# EAGLE design musicbox-addon (EAGLE 9.6.2)
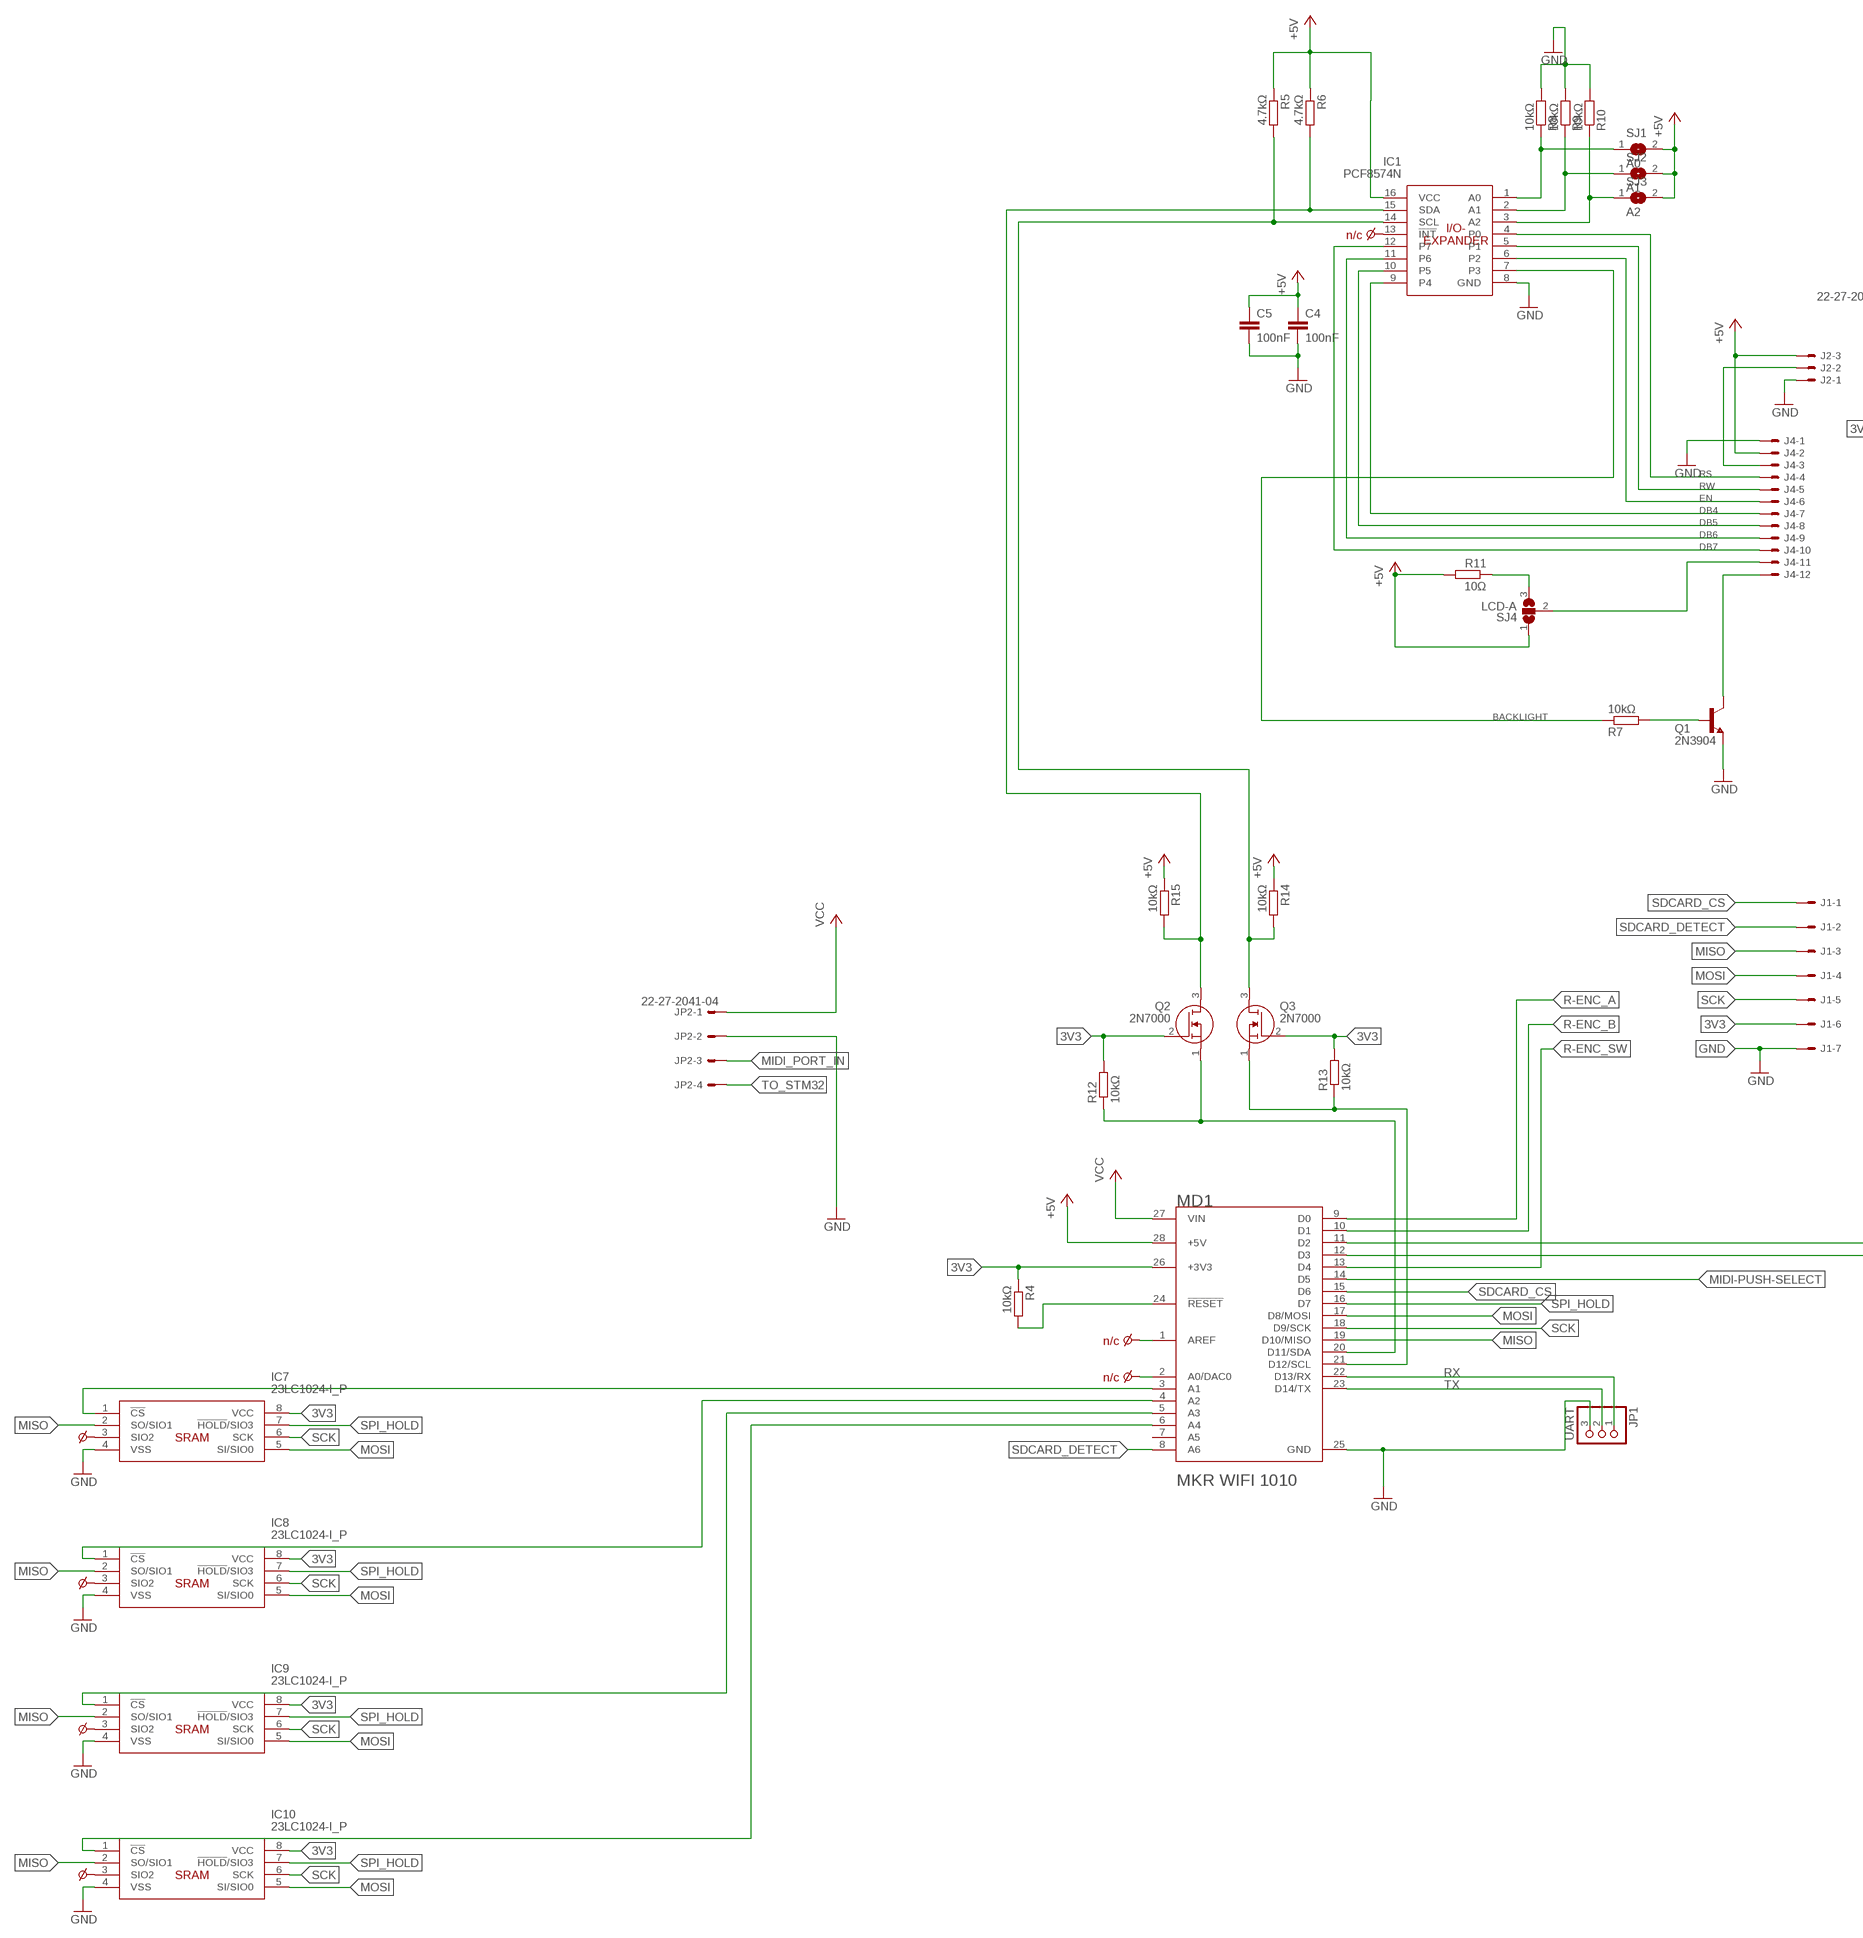
[diagram p0: schematic, sheet 1, part 1 of 2]
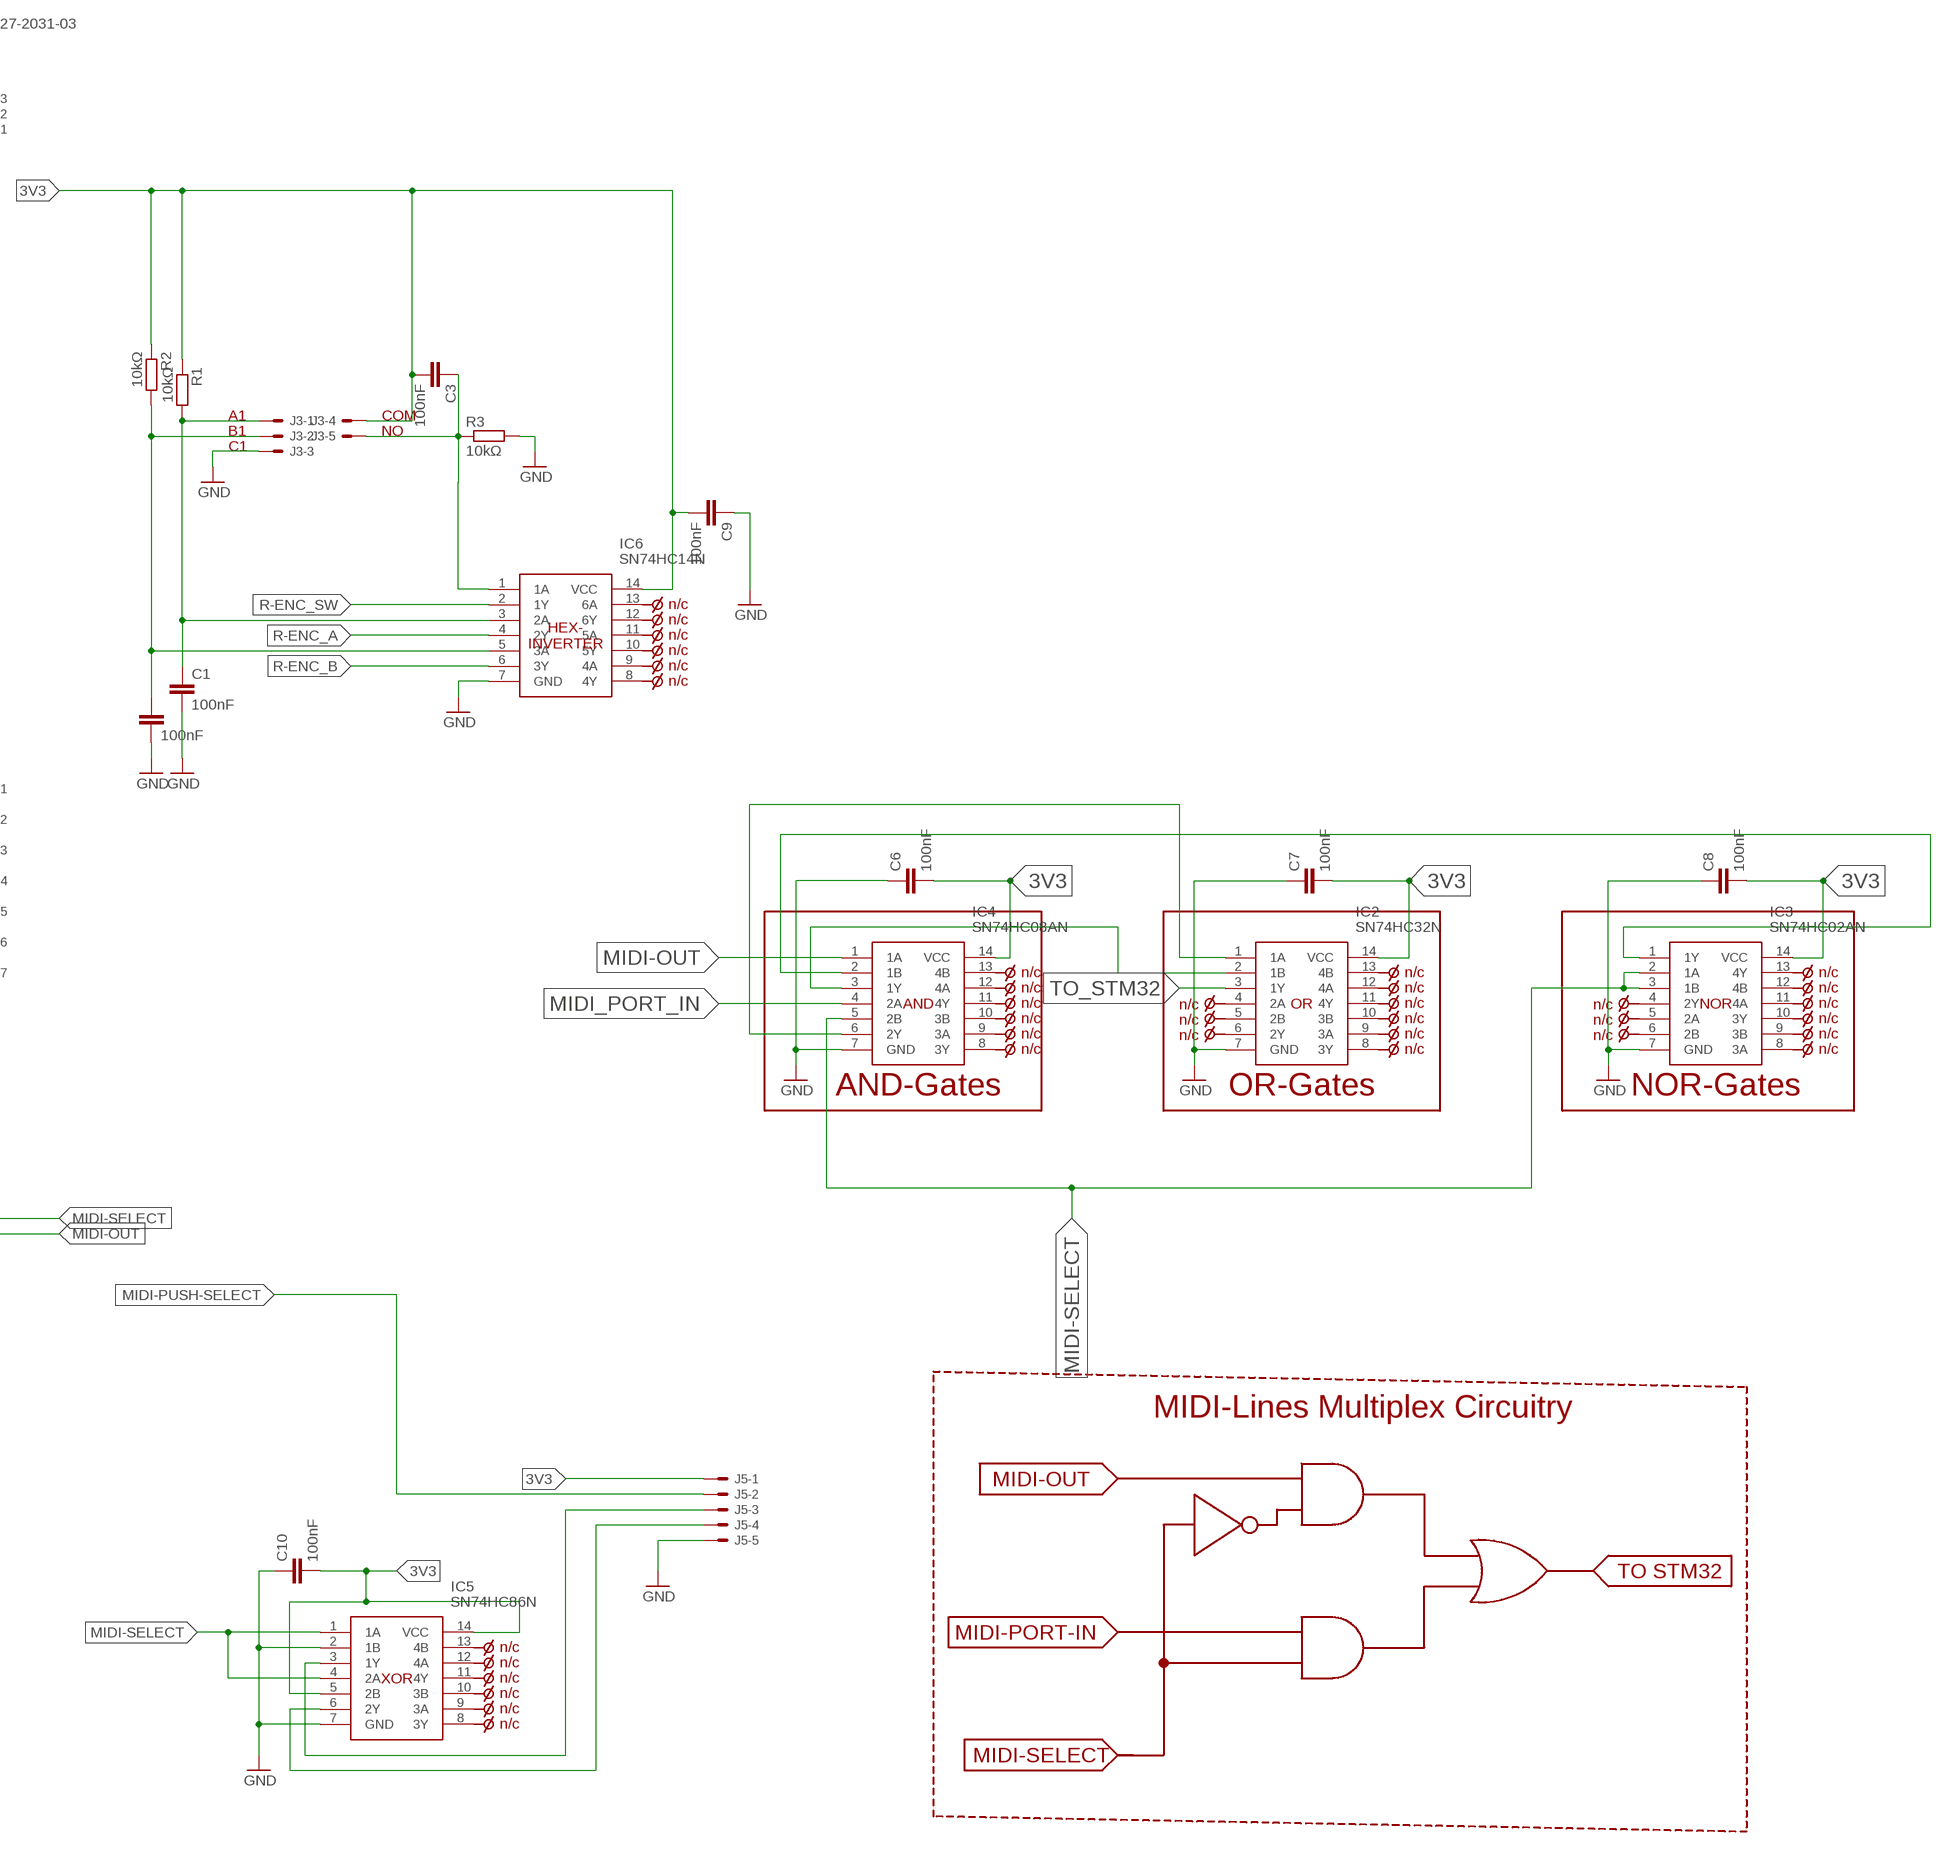
[diagram p1: schematic, sheet 1, part 2 of 2]

## Parts
C1  100nF  C-EU025-025X050  [C025-025X050]
C2  100nF  C-EU025-025X050  [C025-025X050]
C3  100nF  C-EU025-025X050  [C025-025X050]
C4  100nF  C-EU025-025X050  [C025-025X050]
C5  100nF  C-EU025-025X050  [C025-025X050]
C6  100nF  C-EU025-025X050  [C025-025X050]
C7  100nF  C-EU025-025X050  [C025-025X050]
C8  100nF  C-EU025-025X050  [C025-025X050]
C9  100nF  C-EU025-025X050  [C025-025X050]
C10  100nF  C-EU025-025X050  [C025-025X050]
IC1  PCF8574N  [DIP794W53P254L1930H508Q16N]
IC2  SN74HC32N  [DIP794W53P254L1930H508Q14N]
IC3  SN74HC02AN  [DIP794W53P254L1930H508Q14N]
IC4  SN74HC08AN  [DIP794W53P254L1930H508Q14N]
IC5  SN74HC86N  [DIP794W53P254L1930H508Q14N]
IC6  SN74HC14N  [DIP794W53P254L1930H508Q14N]
IC7  23LC1024-I_P  [DIP781W56P254L950H533Q8N]
IC8  23LC1024-I_P  [DIP781W56P254L950H533Q8N]
IC9  23LC1024-I_P  [DIP781W56P254L950H533Q8N]
IC10  23LC1024-I_P  [DIP781W56P254L950H533Q8N]
J1  22-27-2071-07  [6410-07]
J2  22-27-2031-03  [6410-03]
J3  22-27-2051-05  [6410-05]
J4  22-27-2121-12  [6410-12]
J5  22-27-2051-05  [6410-05]
JP1  UART  PINHD-1X3  [1X03]
JP2  22-27-2041-04  [6410-04]
MD1  ARDUINO_MKR_WIFI_1010ARDUINO_MKR_WIFI_1010_0_0  [ARDUINO_MKR_WIFI_1010_0]
Q1  2N3904  [TO92]
Q2  2N7000  [TO-92_(TO-226)]
Q3  2N7000  [TO-92_(TO-226)]
R1  10kΩ  R-EU_0207/7  [0207/7]
R2  10kΩ  R-EU_0207/7  [0207/7]
R3  10kΩ  R-EU_0207/7  [0207/7]
R4  10kΩ  R-EU_0207/7  [0207/7]
R5  4.7kΩ  R-EU_0207/7  [0207/7]
R6  4.7kΩ  R-EU_0207/7  [0207/7]
R7  10kΩ  R-EU_0207/7  [0207/7]
R8  10kΩ  R-EU_0207/7  [0207/7]
R9  10kΩ  R-EU_0207/7  [0207/7]
R10  10kΩ  R-EU_0207/7  [0207/7]
R11  10Ω  R-EU_0207/7  [0207/7]
R12  10kΩ  R-EU_0207/7  [0207/7]
R13  10kΩ  R-EU_0207/7  [0207/7]
R14  10kΩ  R-EU_0207/7  [0207/7]
R15  10kΩ  R-EU_0207/7  [0207/7]
SJ1  A0  SJ  [SJ]
SJ2  A1  SJ  [SJ]
SJ3  A2  SJ  [SJ]
SJ4  LCD-A  SJ2W  [SJ_2]
U$1  N/C-ALT-WITH-TEXT  (no package)
U$2  N/C-ALT-WITH-TEXT  (no package)
U$3  N/C-ALT-WITH-TEXT  (no package)
U$4  N/C-ALT-WITH-TEXT  (no package)
U$5  N/C-ALT-WITH-TEXT  (no package)
U$6  N/C-ALT-WITH-TEXT  (no package)
U$7  N/C-ALT-WITH-TEXT  (no package)
U$8  N/C-ALT-WITH-TEXT  (no package)
U$9  N/C-ALT-WITH-TEXT  (no package)
U$10  N/C-ALT-WITH-TEXT  (no package)
U$11  N/C-ALT-WITH-TEXT  (no package)
U$12  N/C-ALT-WITH-TEXT  (no package)
U$13  N/C-ALT-WITH-TEXT  (no package)
U$14  N/C-ALT-WITH-TEXT  (no package)
U$15  N/C-ALT-WITH-TEXT  (no package)
U$16  N/C-ALT-WITH-TEXT  (no package)
U$17  N/C-ALT  (no package)
U$18  N/C-ALT  (no package)
U$19  N/C-ALT  (no package)
U$20  N/C-ALT  (no package)
U$21  N/C-ALT-WITH-TEXT  (no package)
U$22  N/C-ALT-WITH-TEXT  (no package)
U$23  N/C-ALT-WITH-TEXT  (no package)
U$24  N/C-ALT-WITH-TEXT  (no package)
U$25  N/C-ALT-WITH-TEXT  (no package)
U$26  N/C-ALT-WITH-TEXT  (no package)
U$27  N/C-ALT-WITH-TEXT  (no package)
U$28  N/C-ALT-WITH-TEXT  (no package)
U$29  N/C-ALT-WITH-TEXT  (no package)
U$30  N/C-ALT-WITH-TEXT  (no package)
U$31  N/C-ALT-WITH-TEXT  (no package)
U$32  N/C-ALT-WITH-TEXT  (no package)
U$33  N/C-ALT-WITH-TEXT  (no package)
U$34  N/C-ALT-WITH-TEXT  (no package)
U$35  N/C-ALT-WITH-TEXT  (no package)
U$36  N/C-ALT-WITH-TEXT  (no package)
U$37  N/C-ALT-WITH-TEXT  (no package)
U$38  N/C-ALT-WITH-TEXT  (no package)
U$39  N/C-ALT-WITH-TEXT  (no package)
U$40  N/C-ALT-WITH-TEXT  (no package)
U$41  N/C-ALT-WITH-TEXT  (no package)
U$42  N/C-ALT-WITH-TEXT  (no package)
U$43  N/C-ALT-WITH-TEXT  (no package)

## Nets
3V3: C3.2 C6.2 C7.2 C8.2 C9.2 C10.2 IC2.14(VCC) IC3.14(VCC) IC4.14(VCC) IC5.5(2B) IC5.14(VCC) IC6.14(VCC) IC7.8(VCC) IC8.8(VCC) IC9.8(VCC) IC10.8(VCC) J1.6 J3.4 J5.1 MD1.26(+3V3) Q2.2(G) Q3.2(G) R1.1 R2.1 R4.1 R12.2 R13.2
+5V: C4.1 C5.1 IC1.16(VCC) J2.3 J4.2 MD1.28(+5V) R5.1 R6.1 R11.2 R14.1 R15.1 SJ1.2 SJ2.2 SJ3.2 SJ4.1
BACKLIGHT: IC1.7(P3) R7.1
DB4: IC1.9(P4) J4.7
DB5: IC1.10(P5) J4.8
DB6: IC1.11(P6) J4.9
DB7: IC1.12(P7) J4.10
EN: IC1.6(P2) J4.6
GND: C1.2 C2.2 C4.2 C5.2 C6.1 C7.1 C8.1 C9.1 C10.1 IC1.8(GND) IC2.7(GND) IC3.7(GND) IC4.7(GND) IC5.2(1B) IC5.7(GND) IC6.7(GND) IC7.4(VSS) IC8.4(VSS) IC9.4(VSS) IC10.4(VSS) J1.7 J2.1 J3.3 J4.1 J5.5 JP1.3 JP2.2 MD1.25(GND) Q1.3(E) R3.2 R8.2 R9.2 R10.2
I2C_SCL: IC1.14(SCL) Q3.3(D) R5.2 R14.2
I2C_SDA: IC1.15(SDA) Q2.3(D) R6.2 R15.2
MIDI-OUT: IC4.1(1A) MD1.12(D3)
MIDI-PUSH-SELECT: J5.2 MD1.14(D5)
MIDI-SELECT: IC3.2(1A) IC3.3(1B) IC4.5(2B) IC5.1(1A) IC5.4(2A) MD1.11(D2)
MIDI_PORT_IN: IC4.4(2A) JP2.3
MISO: IC7.2(SO/SIO1) IC8.2(SO/SIO1) IC9.2(SO/SIO1) IC10.2(SO/SIO1) J1.3 MD1.19(D10/MISO)
MOSI: IC7.5(SI/SIO0) IC8.5(SI/SIO0) IC9.5(SI/SIO0) IC10.5(SI/SIO0) J1.4 MD1.17(D8/MOSI)
N$1: IC1.3(A2) R10.1 SJ3.1
N$2: IC1.1(A0) R8.1 SJ1.1
N$3: IC1.2(A1) R9.1 SJ2.1
N$5: C3.1 IC6.1(1A) J3.5 R3.1
N$6: MD1.24(!RESET!) R4.2
N$7: MD1.21(D12/SCL) Q3.1(S) R13.1
N$8: MD1.1(AREF) U$1.P$1
N$9: IC2.2(1B) IC4.3(1Y)
N$10: IC3.1(1Y) IC4.2(1B)
N$11: IC2.1(1A) IC4.6(2Y)
N$12: J4.11 SJ4.2
N$13: IC6.13(6A) U$2.P$1
N$14: IC6.12(6Y) U$3.P$1
N$15: IC6.11(5A) U$4.P$1
N$16: R11.1 SJ4.3
N$17: IC6.10(5Y) U$5.P$1
N$18: IC5.3(1Y) J5.3
N$19: IC5.6(2Y) J5.4
N$20: IC6.9(4A) U$6.P$1
N$21: IC6.8(4Y) U$7.P$1
N$22: IC1.13(!INT) U$8.P$1
N$23: MD1.20(D11/SDA) Q2.1(S) R12.1
N$24: IC7.3(SIO2) U$17.P$1
N$25: IC8.3(SIO2) U$18.P$1
N$26: IC9.3(SIO2) U$19.P$1
N$27: Q1.2(B) R7.2
N$28: IC10.3(SIO2) U$20.P$1
N$29: J2.2 J4.3
N$30: IC7.1(!CS) MD1.3(A1)
N$31: MD1.2(A0/DAC0) U$9.P$1
N$32: IC5.13(4B) U$10.P$1
N$33: IC5.12(4A) U$11.P$1
N$34: IC8.1(!CS) MD1.4(A2)
N$35: IC9.1(!CS) MD1.5(A3)
N$36: IC10.1(!CS) MD1.6(A4)
N$37: IC5.11(4Y) U$12.P$1
N$38: J4.12 Q1.1(C)
N$39: IC5.10(3B) U$13.P$1
N$40: IC5.9(3A) U$14.P$1
N$41: IC5.8(3Y) U$15.P$1
N$42: IC4.13(4B) U$16.P$1
N$44: IC4.12(4A) U$21.P$1
N$45: IC4.11(4Y) U$22.P$1
N$46: IC4.10(3B) U$23.P$1
N$47: IC4.9(3A) U$24.P$1
N$48: IC4.8(3Y) U$25.P$1
N$49: IC2.13(4B) U$26.P$1
N$50: IC2.12(4A) U$27.P$1
N$51: IC2.11(4Y) U$28.P$1
N$52: IC2.10(3B) U$29.P$1
N$53: IC2.9(3A) U$30.P$1
N$54: IC2.8(3Y) U$31.P$1
N$55: IC2.4(2A) U$32.P$1
N$56: IC2.5(2B) U$33.P$1
N$57: IC2.6(2Y) U$34.P$1
N$58: IC3.4(2Y) U$35.P$1
N$59: IC3.5(2A) U$36.P$1
N$60: IC3.6(2B) U$37.P$1
N$61: IC3.13(4Y) U$38.P$1
N$62: IC3.12(4B) U$39.P$1
N$63: IC3.11(4A) U$40.P$1
N$64: IC3.10(3Y) U$41.P$1
N$65: IC3.9(3B) U$42.P$1
N$66: IC3.8(3A) U$43.P$1
R-ENC_A: IC6.4(2Y) MD1.9(D0)
R-ENC_B: IC6.6(3Y) MD1.10(D1)
R-ENC_SW: IC6.2(1Y) MD1.13(D4)
R_ENC_A: C1.1 IC6.3(2A) J3.1 R1.2
R_ENC_B: C2.1 IC6.5(3A) J3.2 R2.2
RS: IC1.4(P0) J4.4
RW: IC1.5(P1) J4.5
RX: JP1.1 MD1.22(D13/RX)
SCK: IC7.6(SCK) IC8.6(SCK) IC9.6(SCK) IC10.6(SCK) J1.5 MD1.18(D9/SCK)
SDCARD_CS: J1.1 MD1.15(D6)
SDCARD_DETECT: J1.2 MD1.8(A6)
SPI_HOLD: IC7.7(!HOLD!/SIO3) IC8.7(!HOLD!/SIO3) IC9.7(!HOLD!/SIO3) IC10.7(!HOLD!/SIO3) MD1.16(D7)
TO_STM32: IC2.3(1Y) JP2.4
TX: JP1.2 MD1.23(D14/TX)
VCC: JP2.1 MD1.27(VIN)
Unconnected: MD1.7(A5)

## Notes on the sheet
- I/O-
  EXPANDER
- A1 | COM
- B1 | NO
- C1
- HEX-
  INVERTER
- AND | OR | NOR
- AND-Gates | OR-Gates | NOR-Gates
- MIDI-Lines Multiplex Circuitry
- SRAM
- MIDI-OUT
- TO STM32
- MIDI-PORT-IN
- SRAM
- XOR
- MIDI-SELECT
- SRAM
- SRAM

## Library data of the parts
C1-C10 = rcl:C-EU: CAPACITOR, European symbol; DIGIKEY_PART_NUMBER: BC5142-ND; FARNELL_PART_NUMBER: 2112909; MANUFACTURER_NAME: Vishay / BC Components; MOUSER_PART_NUMBER: 594-K104M15X7RF53L2; SPICEPREFIX: C
IC1 = PCF8574N:PCF8574N: REMOTE 8-BIT I/O EXPANDER FOR I2C BUS Source: Datasheet <http://componentsearchengine.com/Datasheets/3/PCF8574N.pdf>; ARROW_PART_NUMBER: PCF8574N; ARROW_PRICE-STOCK: https://www.arrow.com/en/products/pcf8574n/texas-instruments; DESCRIPTION: REMOTE 8-BIT I/O EXPANDER FOR I2C BUS; DIGIKEY_PART_NUMBER: 296-13109-5-ND; FARNELL_PART_NUMBER: 3124744; HEIGHT: 5.08mm; MANUFACTURER_NAME: Texas Instruments; MANUFACTURER_PART_NUMBER: PCF8574N; MOUSER_PART_NUMBER: 595-PCF8574N; MOUSER_PRICE-STOCK: https://www.mouser.co.uk/ProductDetail/Texas-Instruments/PCF8574N?qs=L5CvrNUdZirGmsfmc3baKQ%3D%3D
IC2 = SN74HC32N:SN74HC32N: QUADRUPLE 2-INPUT POSITIVE-OR GATES Source: Datasheet <http://www.ti.com/lit/gpn/sn74hc32>; ARROW_PART_NUMBER: SN74HC32N; ARROW_PRICE-STOCK: https://www.arrow.com/en/products/sn74hc32n/texas-instruments; DESCRIPTION: QUADRUPLE 2-INPUT POSITIVE-OR GATES; DIGIKEY_PART_NUMBER: 296-1589-5-ND; FARNELL_PART_NUMBER: 3120475; HEIGHT: 5.08mm; MANUFACTURER_NAME: Texas Instruments; MANUFACTURER_PART_NUMBER: SN74HC32N; MOUSER_PART_NUMBER: 595-SN74HC32N; MOUSER_PRICE-STOCK: https://www.mouser.co.uk/ProductDetail/Texas-Instruments/SN74HC32N?qs=tJ5HNKWh3OWs99bm2e8RtQ%3D%3D
IC3 = SN74HC02AN:SN74HC02AN: Logic Gates Source: Datasheet <https://www.ti.com/lit/ds/symlink/sn74hc02.pdf?ts=1601064086145&ref_url=https%3A%2F%2Fwww.ti.com%2Fproduct%2FSN74HC02%3FkeyMatch%3DSN74HC02AN%26tisearch%3DSearch-EN-everything%26usecase%3DGPN>; DESCRIPTION: Logic Gates; DIGIKEY_PART_NUMBER: 296-SN74HC02AN-ND; FARNELL_PART_NUMBER: 3120423; HEIGHT: 5.08mm; MANUFACTURER_NAME: Texas Instruments; MANUFACTURER_PART_NUMBER: SN74HC02AN; MOUSER_PART_NUMBER: 595-SN74HC02AN; MOUSER_PRICE-STOCK: https://www.mouser.co.uk/ProductDetail/Texas-Instruments/SN74HC02AN?qs=byeeYqUIh0PiudgMmE6ZKA%3D%3D
IC4 = SN74HC08AN:SN74HC08AN: SNx4HC08 Quadruple 2-Input AND Gates Source: Datasheet <https://www.ti.com/lit/ds/symlink/sn74hc08.pdf?ts=1601064135330&ref_url=https%3A%2F%2Fwww.ti.com%2Fproduct%2FSN74HC08%3FkeyMatch%3DSN74HC08AN%26tisearch%3DSearch-EN-everything%26usecase%3DGPN>; DESCRIPTION: SNx4HC08 Quadruple 2-Input AND Gates; DIGIKEY_PART_NUMBER: 296-1570-5-ND; FARNELL_PART_NUMBER: 3120441; HEIGHT: 5.08mm; MANUFACTURER_NAME: Texas Instruments; MANUFACTURER_PART_NUMBER: SN74HC08AN; MOUSER_PART_NUMBER: 595-SN74HC08AN; MOUSER_PRICE-STOCK: https://www.mouser.co.uk/ProductDetail/Texas-Instruments/SN74HC08AN?qs=byeeYqUIh0O9MyGywGYg%252Bw%3D%3D
IC5 = SN74HC86N:SN74HC86N: QUADRUPLE 2-INPUT EXCLUSIVE-OR GATES Source: Datasheet <http://componentsearchengine.com/Datasheets/1/SN74HC86N.pdf>; ARROW_PART_NUMBER: SN74HC86N; ARROW_PRICE-STOCK: https://www.arrow.com/en/products/sn74hc86n/texas-instruments; DESCRIPTION: QUADRUPLE 2-INPUT EXCLUSIVE-OR GATES; DIGIKEY_PART_NUMBER: 296-8375-5-ND; FARNELL_PART_NUMBER: 3006572; HEIGHT: 5.08mm; MANUFACTURER_NAME: Texas Instruments; MANUFACTURER_PART_NUMBER: SN74HC86N; MOUSER_PART_NUMBER: 595-SN74HC86N; MOUSER_PRICE-STOCK: https://www.mouser.co.uk/ProductDetail/Texas-Instruments/SN74HC86N?qs=st7IWvlL5%2FhKYw089MjkZw%3D%3D
IC6 = SN74HC14N:SN74HC14N: Hex invertor,SN74HC14N DIP14 2-6V 25pcs Source: Datasheet <http://componentsearchengine.com/Datasheets/3/SN74HC14N.pdf>; ARROW_PART_NUMBER: SN74HC14N; ARROW_PRICE-STOCK: https://www.arrow.com/en/products/sn74hc14n/texas-instruments?region=nac; DESCRIPTION: Hex invertor,SN74HC14N DIP14 2-6V 25pcs; DIGIKEY_PART_NUMBER: 296-1577-5-ND; FARNELL_PART_NUMBER: 3120458; HEIGHT: 5.08mm; MANUFACTURER_NAME: Texas Instruments; MANUFACTURER_PART_NUMBER: SN74HC14N; MOUSER_PART_NUMBER: 595-SN74HC14N; MOUSER_PRICE-STOCK: https://www.mouser.co.uk/ProductDetail/Texas-Instruments/SN74HC14N?qs=tJ5HNKWh3OVki9FUzGEzjg%3D%3D
IC7-IC10 = 23LC1024-I_P:23LC1024-I_P: SRAM,1Mbit,2.5V,20MHz,SPI/SDI/SQI,DIP8 Microchip 23LC1024-I/P SRAM Memory, 1Mbit, 2.5 to 5.5 V 8-Pin PDIP Source: Datasheet <https://datasheet.datasheetarchive.com/originals/distributors/Datasheets-DGA23/1494997.pdf>; ARROW_PART_NUMBER: 23LC1024-I/P; ARROW_PRICE-STOCK: https://www.arrow.com/en/products/23lc1024-ip/microchip-technology?region=nac; DESCRIPTION: SRAM,1Mbit,2.5V,20MHz,SPI/SDI/SQI,DIP8 Microchip 23LC1024-I/P SRAM Memory, 1Mbit, 2.5 to 5.5 V 8-Pin PDIP; DIGIKEY_PART_NUMBER: 23LC1024-I/P-ND; FARNELL_PART_NUMBER: 2212152; HEIGHT: 5.334mm; MANUFACTURER_NAME: Microchip; MANUFACTURER_PART_NUMBER: 23LC1024-I/P; MOUSER_PART_NUMBER: 579-23LC1024-I/P; MOUSER_PRICE-STOCK: https://www.mouser.co.uk/ProductDetail/Microchip-Technology/23LC1024-I-P?qs=q1LPnGnpSmYcdUMByAoiMQ%3D%3D
J1 = con-molex:22-?-07: CONNECTOR wire to board 2.54 mm (.1 inch) pitch header; DIGIKEY_PART_NUMBER: WM4116-ND; FARNELL_PART_NUMBER: 2112410; MANUFACTURER_NAME: Molex; MF: MOLEX; MOUSER_PART_NUMBER: 538-22-27-2071; OC_FARNELL: unknown; OC_NEWARK: unknown
J2 = con-molex:22-?-03: CONNECTOR wire to board 2.54 mm (.1 inch) pitch header; DIGIKEY_PART_NUMBER: WM4112-ND; FARNELL_PART_NUMBER: 9731156; MANUFACTURER_NAME: Molex; MF: MOLEX; MOUSER_PART_NUMBER: 538-22-27-2031; OC_FARNELL: unknown; OC_NEWARK: unknown
J3 J5 = con-molex:22-?-05: CONNECTOR wire to board 2.54 mm (.1 inch) pitch header; DIGIKEY_PART_NUMBER: WM4114-ND; FARNELL_PART_NUMBER: 9731679; MANUFACTURER_NAME: Molex; MF: MOLEX; MOUSER_PART_NUMBER: 538-22-27-2051; OC_FARNELL: unknown; OC_NEWARK: unknown
J4 = con-molex:22-?-12: CONNECTOR wire to board 2.54 mm (.1 inch) pitch header; DIGIKEY_PART_NUMBER: 23-0022272121-ND; FARNELL_PART_NUMBER: 9732560; MANUFACTURER_NAME: Molex; MF: MOLEX; MOUSER_PART_NUMBER: 538-22-27-2121; OC_FARNELL: unknown; OC_NEWARK: unknown
JP1 = pinhead:PINHD-1X3: PIN HEADER; DIGIKEY_PART_NUMBER: 68002-403-ND; FARNELL_PART_NUMBER: 3881564; MANUFACTURER_NAME: Amphenol FCI; MOUSER_PART_NUMBER: 649-1012937890301BLF
JP2 = con-molex:22-?-04: CONNECTOR wire to board 2.54 mm (.1 inch) pitch header; MF: MOLEX; OC_FARNELL: unknown; OC_NEWARK: unknown
MD1 = Arduino - MKR WIFI 1010:ARDUINO_MKR_WIFI_1010: Arduino MKR WiFi 1010; AUTOMOTIVE: No; CENTROID_NOT_SPECIFIED: No; CORE_ARCHITECTURE: ARM Cortex-M0+; DATASHEET: https://store.arduino.cc/mkr-wifi-1010; DATA_BUS_WIDTH: 32bits; DEVICE_CLASS_L1: Integrated Circuits (ICs); DEVICE_CLASS_L2: Embedded Processors and Controllers; DEVICE_CLASS_L3: Microcontrollers; DIGIKEY_DESCRIPTION: UNK ARDUINO MKR WIFI 1010; DIGIKEY_PART_NUMBER: 1050-1162-ND; FARNELL_PART_NUMBER: 2917569; FOOTPRINT_VARIANT_NAME_0: Recommended_Land_Pattern; FREQUENCY: 48MHz; INTERFACE: I2C,SPI,UART,I2S; LEAD_FREE: Yes; MAX_SUPPLY_VOLTAGE: 5V; MEMORY_SIZE: 256KBytes; MEMORY_TYPE: FLASH; MF: Arduino; MFG_PACKAGE_IDENT: MKR WIFI 1010; MFG_PACKAGE_IDENT_DATE: 0; MFG_PACKAGE_IDENT_REV: 0; MIN_SUPPLY_VOLTAGE: 3.3V; MOUSER_PART_NUMBER: 782-ABX00023; MPN: MKR WIFI 1010; NUMBER_OF_A/D_CONVERTERS: 1; NUMBER_OF_ADC_CHANNELS: 7; NUMBER_OF_I/OS: 8; NUMBER_OF_I2C_CHANNELS: 1; NUMBER_OF_PWM_CHANNELS: 12; NUMBER_OF_SPI_CHANNELS: 1; NUMBER_OF_UART_CHANNELS: 1; PACKAGE: EVALUATION_BOARD; PREFIX: MD; RAM_SIZE: 32KBytes; ROHS: Yes; VERIFICATION_VERSION: 0.0.0.3
Q1 = transistor-npn:2N3904: NPN Transistor; DIGIKEY_PART_NUMBER: 1514-2N3904PBFREE-ND; FARNELL_PART_NUMBER: 9846743; MANUFACTURER_NAME: Central Semiconductor; MOUSER_PART_NUMBER: 610-2N3904
Q2 Q3 = 2N7000:2N7000: N-channel MOSFET,2N7000 0.2A 60V Source: Datasheet <http://www.onsemi.com/pub/Collateral/NDS7002A-D.PDF>; ARROW_PART_NUMBER: 2N7000; ARROW_PRICE-STOCK: https://www.arrow.com/en/products/2n7000/on-semiconductor?region=nac; DESCRIPTION: N-channel MOSFET,2N7000 0.2A 60V; DIGIKEY_PART_NUMBER: 2N7000FS-ND; FARNELL_PART_NUMBER: 9845178; HEIGHT: mm; MANUFACTURER_NAME: onsemi; MANUFACTURER_PART_NUMBER: 2N7000; MOUSER_PART_NUMBER: 512-2N7000; MOUSER_PRICE-STOCK: https://www.mouser.co.uk/ProductDetail/ON-Semiconductor-Fairchild/2N7000?qs=FOlmdCx%252BAA2o%2FKZOTk%2F3hg%3D%3D
R1-R4 R7-R10 R12-R15 = rcl:R-EU_: RESISTOR, European symbol; DIGIKEY_PART_NUMBER: BC3569CT-ND; FARNELL_PART_NUMBER: 1652647; MANUFACTURER_NAME: Vishay / Beyschlag; MOUSER_PART_NUMBER: 594-MBB02070C1002FCT; SPICEPREFIX: R
R5 R6 = rcl:R-EU_: RESISTOR, European symbol; DIGIKEY_PART_NUMBER: BC3792CT-ND; FARNELL_PART_NUMBER: 3547015; MANUFACTURER_NAME: Vishay / Beyschlag; MOUSER_PART_NUMBER: 594-MBB02070C4701FCT; SPICEPREFIX: R
R11 = rcl:R-EU_: RESISTOR, European symbol; DIGIKEY_PART_NUMBER: BC3741CT-ND; FARNELL_PART_NUMBER: 3546988; MANUFACTURER_NAME: Vishay / Beyschlag; MOUSER_PART_NUMBER: 594-MBB02070C3300FCT; SPICEPREFIX: R
SJ1-SJ3 = jumper:SJ: SMD solder JUMPER
SJ4 = jumper:SJ2W: SMD solder JUMPER
U$1-U$16 U$21-U$43 = nc-pin:N/C-ALT-WITH-TEXT: N/C Symbol With Label With Pin-Leg Alternative Symbol Slash-Notation; _EXTERNAL_: n/c
U$17-U$20 = nc-pin:N/C-ALT: N/C Symbol No Label With Pin-Leg Alternative Symbol; _EXTERNAL_: n/c

## Board
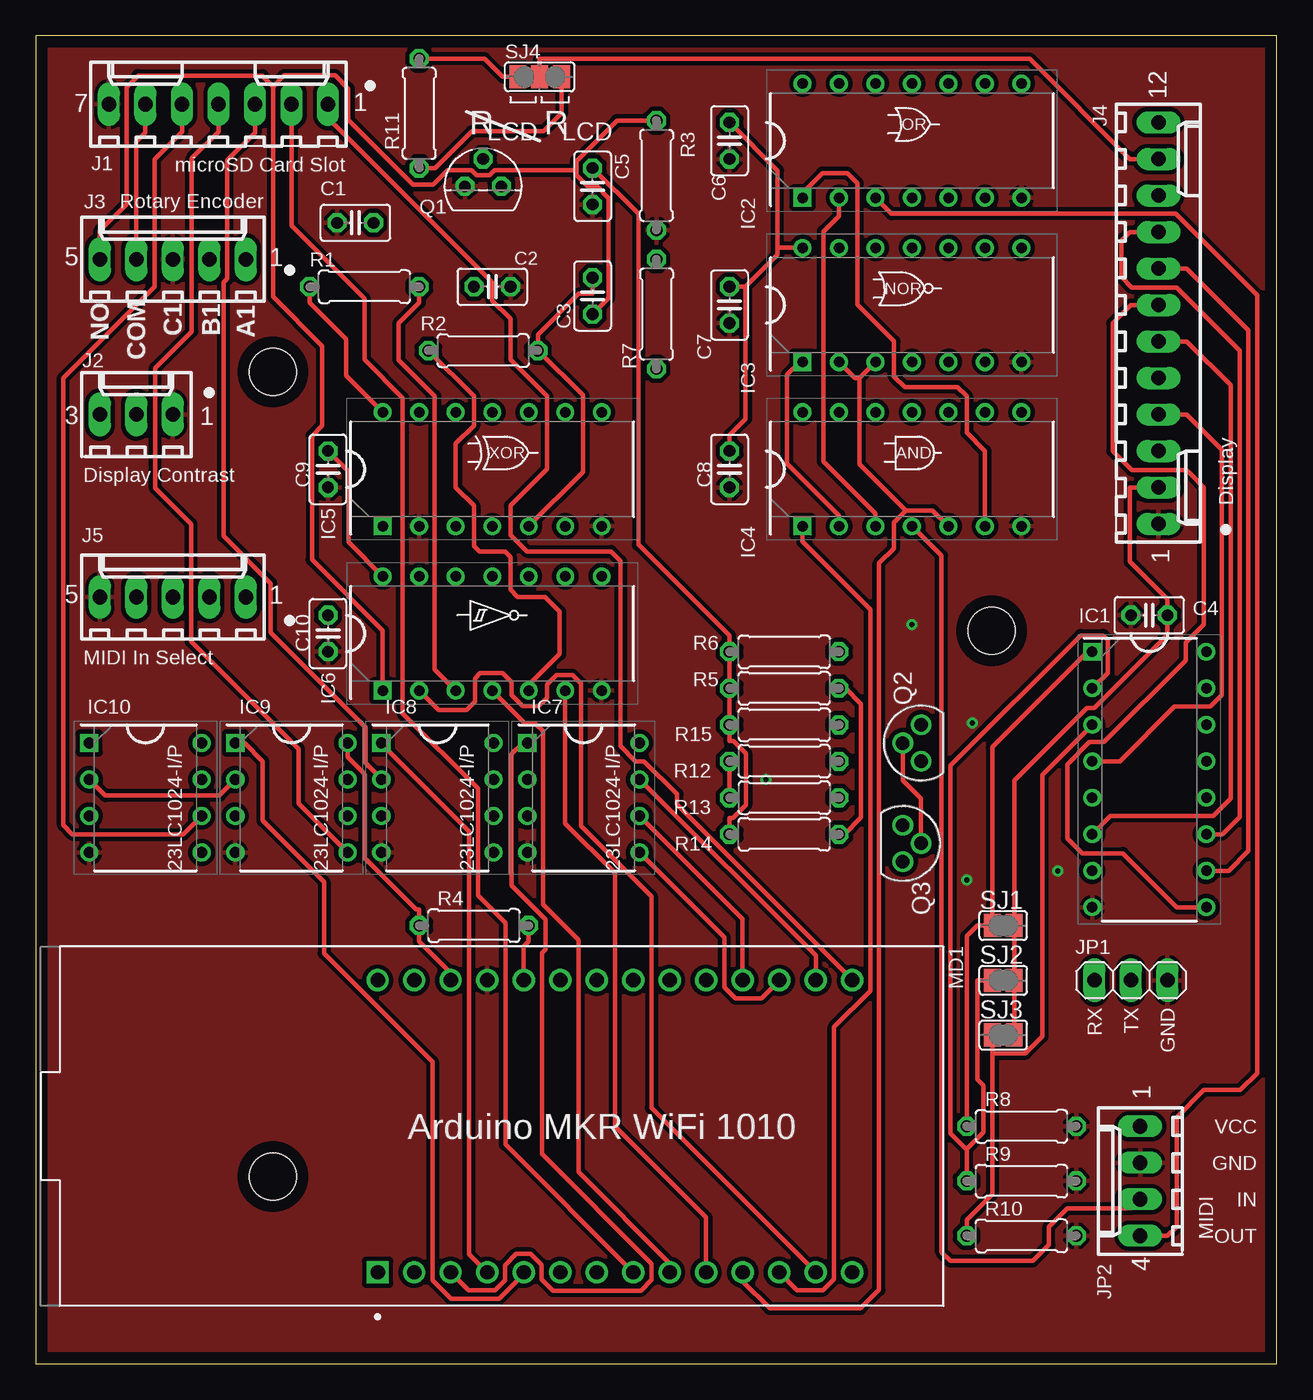
[diagram p2: board, top side]
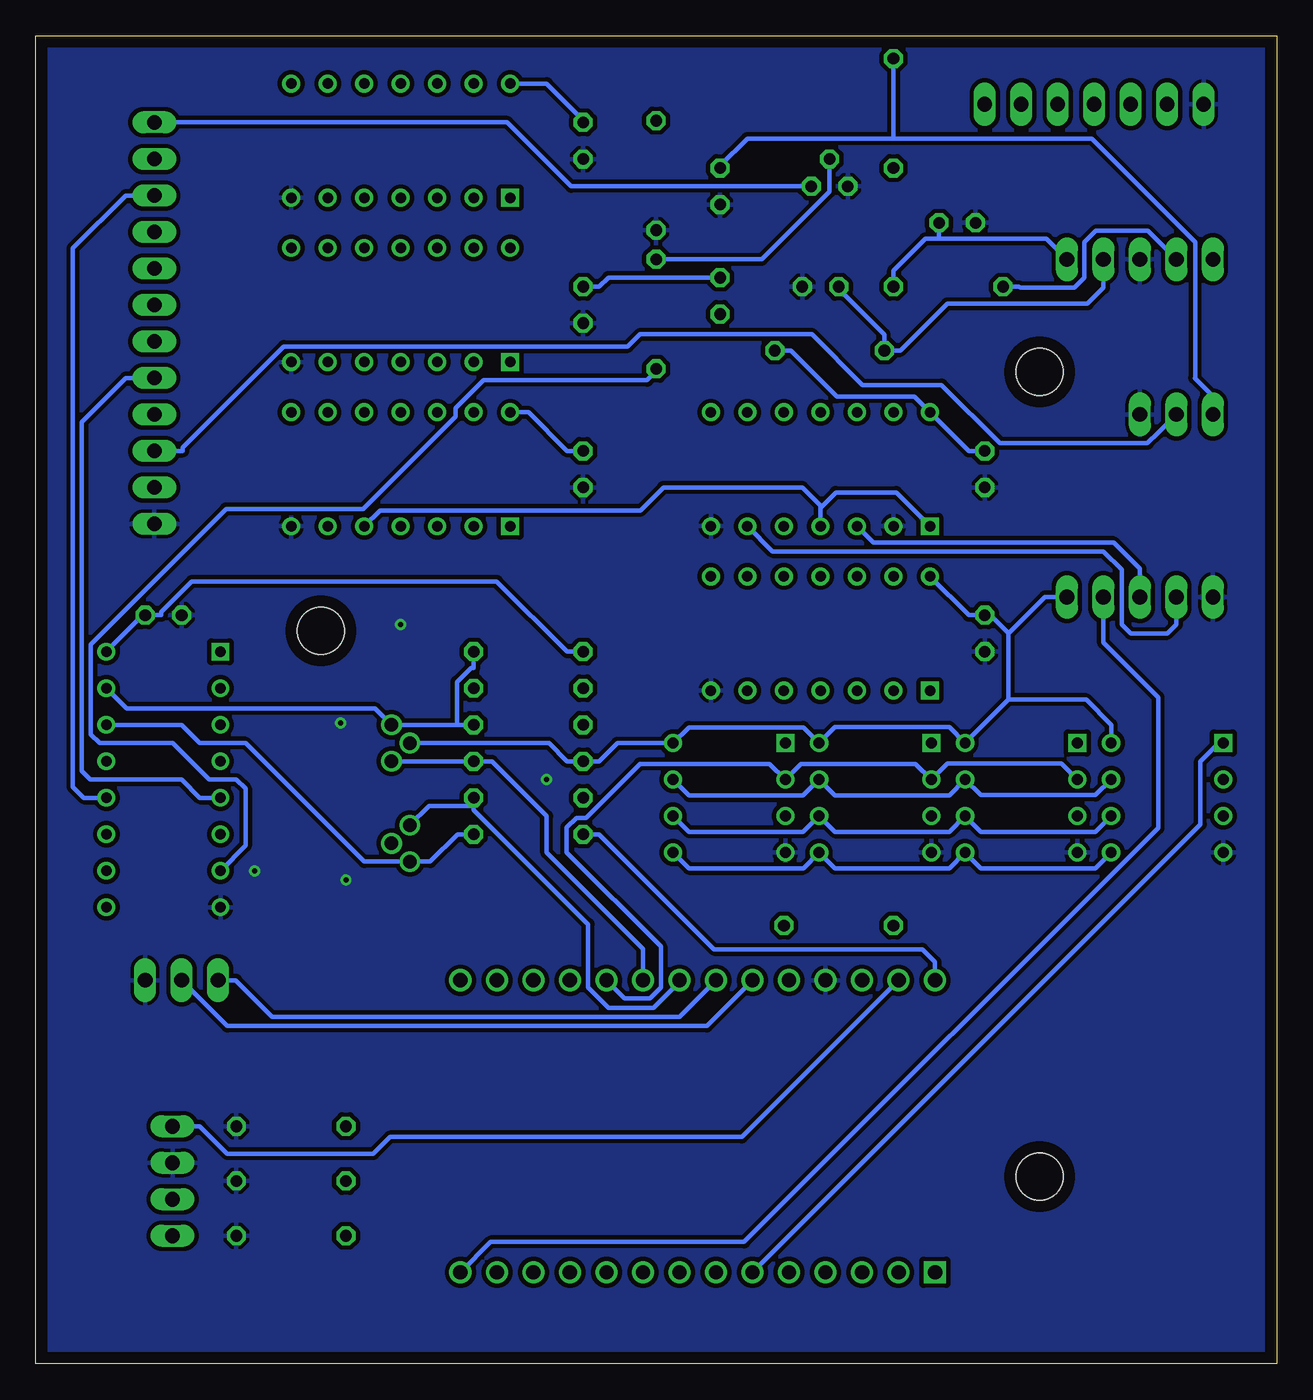
[diagram p3: board, bottom side, seen from below]

Size 86.34 x 92.38 mm. Coordinates in mm from the lower left corner, seen from the top.
Outline: 0,0 86.34,0 86.34,92.38 0,92.38 0,0
Copper layers (1*16): Top 0.035mm / dielectric 1.5mm / Bottom 0.035mm
Design rules "default *": minimum track width 12mil, minimum drill 0.35mm, track to track 12mil, track to pad 12mil, pad to pad 16mil, via to via 16mil, smd to smd 12mil, copper to edge 32mil, drill to drill 6mil, minimum pad ring 10mil, minimum via ring 8mil, stop-mask expansion 4mil, vias tented up to drill 0mil, thermal gap 10mil
Holes 3.28 mm at 16.5,69 66.5,51 16.5,13

### Footprints (pad centres in the part's own frame; a part is rotated, then mirrored left to right if it is on the bottom)
C025-025X050 = drill 0.813 octagon: 1 -1.27,0; 2 1.27,0
DIP794W53P254L1930H508Q16N = drill 0.73 pad 1.13 square: 1 -3.97,8.89 | drill 0.73 pad 1.13: 2 -3.97,6.35; 3 -3.97,3.81; 4 -3.97,1.27; 5 -3.97,-1.27; 6 -3.97,-3.81; 7 -3.97,-6.35; 8 -3.97,-8.89; 9 3.97,-8.89; 10 3.97,-6.35; 11 3.97,-3.81; 12 3.97,-1.27; 13 3.97,1.27; 14 3.97,3.81; 15 3.97,6.35; 16 3.97,8.89
DIP794W53P254L1930H508Q14N = drill 0.73 pad 1.13 square: 1 -3.97,7.62 | drill 0.73 pad 1.13: 2 -3.97,5.08; 3 -3.97,2.54; 4 -3.97,0; 5 -3.97,-2.54; 6 -3.97,-5.08; 7 -3.97,-7.62; 8 3.97,-7.62; 9 3.97,-5.08; 10 3.97,-2.54; 11 3.97,0; 12 3.97,2.54; 13 3.97,5.08; 14 3.97,7.62
DIP781W56P254L950H533Q8N = drill 0.759 pad 1.159 square: 1 -3.905,3.81 | drill 0.759 pad 1.159: 2 -3.905,1.27; 3 -3.905,-1.27; 4 -3.905,-3.81; 5 3.905,-3.81; 6 3.905,-1.27; 7 3.905,1.27; 8 3.905,3.81
6410-07 = drill 1.016 long: 1 7.62,0; 2 5.08,0; 3 2.54,0; 4 0,0; 5 -2.54,0; 6 -5.08,0; 7 -7.62,0
6410-03 = drill 1.016 long: 1 2.54,0; 2 0,0; 3 -2.54,0
6410-05 = drill 1.016 long: 1 5.08,0; 2 2.54,0; 3 0,0; 4 -2.54,0; 5 -5.08,0
6410-12 = drill 1.016 long: 1 13.97,0; 2 11.43,0; 3 8.89,0; 4 6.35,0; 5 3.81,0; 6 1.27,0; 7 -1.27,0; 8 -3.81,0; 9 -6.35,0; 10 -8.89,0; 11 -11.43,0; 12 -13.97,0
1X03 = drill 1.016 long: 1 -2.54,0; 2 0,0; 3 2.54,0
6410-04 = drill 1.016 long: 1 3.81,0; 2 1.27,0; 3 -1.27,0; 4 -3.81,0
ARDUINO_MKR_WIFI_1010_0 = drill 1 pad 1.55 square: 1 -7.97,-10.16 | drill 1 pad 1.55: 2 -5.43,-10.16; 3 -2.89,-10.16; 4 -0.35,-10.16; 5 2.19,-10.16; 6 4.73,-10.16; 7 7.27,-10.16; 8 9.81,-10.16; 9 12.35,-10.16; 10 14.89,-10.16; 11 17.43,-10.16; 12 19.97,-10.16; 13 22.51,-10.16; 14 25.05,-10.16; 15 25.05,10.16; 16 22.51,10.16; 17 19.97,10.16; 18 17.43,10.16; 19 14.89,10.16; 20 12.35,10.16; 21 9.81,10.16; 22 7.27,10.16; 23 4.73,10.16; 24 2.19,10.16; 25 -0.35,10.16; 26 -2.89,10.16; 27 -5.43,10.16; 28 -7.97,10.16
TO92 = drill 0.813 octagon: 1 1.27,0; 2 0,1.905; 3 -1.27,0
TO-92_(TO-226) = drill 0.94 pad 1.44: 1 0,0; 2 -1.27,-1.27; 3 -2.54,0
0207/7 = drill 0.813 octagon: 1 -3.81,0; 2 3.81,0
SJ = smd 1.168 x 1.6: 1 -0.762,0; 2 0.762,0
SJ_2 = smd 1.168 x 1.6: 1 -1.524,0; 2 0,0; 3 1.524,0

### Placement (x,y rotation side)
C1  22.23,79.38 180 top
C2  31.75,74.93 0 top
C3  38.73,74.3 90 top
C4  77.47,52.07 180 top
C5  38.73,81.92 270 top
C6  48.26,85.09 90 top
C7  48.26,73.66 90 top
C8  48.26,62.23 90 top
C9  20.32,62.23 90 top
C10  20.32,50.8 90 top
IC1  77.47,40.64 0 top
IC2  60.96,85.09 90 top
IC3  60.96,73.66 90 top
IC4  60.96,62.23 90 top
IC5  31.75,62.23 90 top
IC6  31.75,50.8 90 top
IC7  38.1,39.37 0 top
IC8  27.94,39.37 0 top
IC9  17.78,39.37 0 top
IC10  7.62,39.37 0 top
J1  12.7,87.63 0 top
J2  6.99,66.04 0 top
J3  9.53,76.83 0 top
J4  78.11,72.39 270 top
J5  9.53,53.34 0 top
JP1  76.2,26.67 0 top
JP2  76.83,12.7 90 top
MD1  31.75,16.51 0 top
Q1  31.11,81.92 0 top
Q2  61.59,41.91 270 top
Q3  60.33,37.47 90 top
R1  22.86,74.93 0 top
R2  31.11,70.48 180 top
R3  43.18,82.68 270 top
R4  30.48,30.48 0 top
R5  52.07,46.99 0 top
R6  52.07,49.53 0 top
R7  43.18,73.03 90 top
R8  68.58,16.51 0 top
R9  68.58,12.7 0 top
R10  68.58,8.89 0 top
R11  26.67,87 90 top
R12  52.07,41.91 180 top
R13  52.07,39.37 180 top
R14  52.07,36.83 0 top
R15  52.07,44.45 0 top
SJ1  67.31,30.48 0 top
SJ2  67.31,26.67 0 top
SJ3  67.31,22.86 0 top
SJ4  35.05,89.53 0 top

### Tracks (layer width: path | path; a pad name or v marks a point on that pad's centre or on a via)
3V3
  Top 0.305: J1.6 7.62,85.65 6.99,85.01 J3.4 | IC6.14 21.74,57.16 21.74,62.08 C9.2 | IC9.8 21.68,42.2 22.86,41.02 22.86,35.18 26.44,31.6 26.67,31.6 R4.1 26.67,29.36 28.86,27.17 MD1.26 | IC5.5 38.05,62.02 38.05,67.38 34.94,70.5 R2.1 34.92,71.6 37.77,74.45 38.73,74.45 C3.2 | 51.6,77.63 51.6,83.02 C6.2 | 49.38,74.93 51.6,77.16 51.6,77.63 | 51.6,77.63 IC3.14 | 49.38,74.93 49.38,65.73 48.26,64.62 C8.2 | C7.2 49.38,74.93 | R1.1 19.05,73.81 21.59,71.27 21.59,68.74 IC5.14 | Q3.2 61.59,39.31 60.33,40.58 Q2.2 | R13.2 R12.2
  Bottom 0.305: R1.1 17.93,74.93 17.86,74.85 14.07,74.85 13.37,75.55 13.37,78.02 12.57,78.82 8.97,78.82 J3.4 | R2.1 33.81,70.48 30.6,67.28 25.21,67.28 IC5.14 21.44,63.5 C9.2 | 18.67,46.19 IC9.8 22.79,44.29 30.74,44.29 IC8.8 32.94,44.27 40.91,44.27 IC7.8 45.87,43.18 47.14,41.91 R12.2 49.38,41.91 50.65,43.18 Q2.2 | IC10.8 11.53,44.45 13.27,46.19 18.67,46.19 | 18.67,46.19 18.67,50.8 | 18.67,50.8 18.67,50.83 19.91,52.07 C10.2 21.44,52.07 21.44,52.08 IC6.14 | IC2.14 50.81,89.06 48.26,86.51 C6.2 | C7.2 47.14,74.93 46.51,75.56 C3.2 | C8.2 49.38,63.5 52.08,66.2 IC4.14 | J5.1 16.13,53.34 18.67,50.8
+5V
  Top 0.305: SJ3.2 SJ2.2 SJ1.2 68.07,31.74 68.07,40.56 73.13,45.61 73.65,45.61 78.74,50.7 C4.1 78.74,53.19 76.12,55.8 76.12,60.96 J4.2 | C5.1 41.92,80 41.92,56.99 48.26,50.65 R6.1 R5.1 R15.1 48.26,43.33 48.54,43.33 49.41,42.47 49.41,38.86 48.49,37.95 48.26,37.95 R14.1 | SJ4.1 32.49,89.53 31.22,90.81 R11.2
  Bottom 0.305: R6.1 49.38,49.53 54.27,54.43 75.5,54.43 77.62,52.3 77.62,52.07 C4.1 78.9,52.07 IC1.16 | 26.67,85.24 36.83,85.24 38.73,83.34 C5.1 | 26.67,85.24 12.88,85.24 5.66,78.03 5.66,68.58 5.71,68.58 4.45,67.31 J2.3 | 26.67,85.24 26.67,89.69 R11.2 | R14.1 47.14,36.83 39.14,28.83 24.67,28.83 23.78,27.94 MD1.28
BACKLIGHT
  Bottom 0.305: R7.1 43.18,69.06 43.82,68.42 55.2,68.42 57.15,66.48 57.15,65.89 63.57,59.47 73.11,59.47 82.53,50.05 82.53,43.79 81.92,43.18 76.83,43.18 74.3,40.64 72.39,40.64 71.75,40.01 71.75,36.03 IC1.7
DB4
  Top 0.305: J4.7 76.2,73.66 74.93,72.39 74.93,63.5 76.25,62.18 80.06,62.18 80.33,61.91 81.28,60.96 81.28,51.44 80.01,50.16 80.01,48.93 74.32,43.24 73.31,43.24 71.75,41.69 71.75,36.55 72.8,35.5 75.62,35.5 79.38,31.75 IC1.9
DB5
  Top 0.305: J4.8 80.09,76.2 84.37,71.92 84.37,35.67 82.99,34.29 IC1.10
DB6
  Top 0.305: J4.9 76.12,78.74 75.51,78.13 75.51,75.62 76.25,74.88 79.37,74.88 82.5,71.75 83.76,70.49 83.76,38.04 82.55,36.83 IC1.11
DB7
  Bottom 0.305: J4.10 80.09,81.28 83.77,77.6 83.77,40.13 83.01,39.37 IC1.12
EN
  Top 0.305: J4.6 80.09,71.12 83.13,68.08 83.13,41.27 83.13,39.31 81.92,38.1 74.77,38.1 IC1.6
GND  (via drill 0.35)
  other vias: 71.12,34.29 50.8,40.64 65.15,44.58 64.77,33.66 60.96,51.44
  pour Top: -3.81,95.25 89.53,95.25 89.53,-5.08 -3.81,-5.08
  pour Bottom: -5.08,95.25 89.53,95.25 89.53,-5.08 -5.08,-5.08
I2C_SCL
  Top 0.305: R5.2 56.31,46.99 57.42,45.88 57.42,37.98 56.26,36.83 R14.2
  Bottom 0.305: R14.2 57,36.83 58.9,34.92 Q3.3 63.5,34.92 71.75,43.18 74.93,43.18 76.2,44.45 IC1.14
I2C_SDA
  Bottom 0.305: IC1.15 80.03,45.58 62.73,45.58 Q2.3 57.05,44.45 | R15.2 57.05,44.45 | 57.05,44.45 57.05,47.43 56.06,48.41 55.88,48.41 R6.2
MIDI-OUT
  Top 0.305: IC4.1 53.34,57.18 58.05,52.47 58.05,25.94 55.53,23.41 55.53,5.87 54.77,5.1 52.97,5.1 MD1.12
MIDI-PUSH-SELECT
  Bottom 0.305: MD1.14 54.69,8.46 37.06,8.46 8.26,37.27 8.26,46.35 12.06,50.16 J5.2
MIDI-SELECT
  Top 0.305: 57.31,68.58 IC3.3 | IC3.2 56.99,68.58 57.31,68.58 | 60.54,59.37 57.31,62.6 57.31,68.58 | 60.54,59.37 62.39,59.37 IC4.5 | MD1.11 49.18,5.71 51.06,3.83 57.38,3.83 58.66,5.12 58.66,55.69 59.69,56.72 59.69,58.52 60.54,59.37
  Bottom 0.305: IC4.5 62.4,59.36 44.28,59.36 42.68,60.96 33.02,60.96 31.75,59.69 IC5.4 31.75,59.53 30.67,60.61 26.48,60.61 IC5.1
MIDI_PORT_IN
  Top 0.305: IC4.4 63.01,56.21 63.01,7.75 63.62,7.13 69.36,7.13 70.48,8.26 70.48,9.53 71.75,10.79 76.2,10.79 JP2.3
MISO
  Top 0.305: IC9.2 12.76,39.53 4.83,39.53 IC10.2 | J1.3 15.24,85.65 13.31,83.72 13.31,75.49 13.05,75.23 13.05,57.58 16.34,54.29 16.34,50.87 22.94,44.27 22.94,41.8 24.04,40.71 IC8.2
  Bottom 0.305: MD1.19 45.4,25.43 43.6,25.43 42.86,26.17 42.86,29.01 49.41,35.56 49.41,37.3 48.73,37.98 48.07,37.98 44.32,41.73 35.29,41.73 IC7.2 33.1,41.74 25.13,41.74 IC8.2 22.93,41.75 14.98,41.75 IC9.2
MOSI
  Top 0.305: MD1.17 50.47,25.42 48.67,25.42 47.91,26.19 47.91,29.66 IC7.5 | IC9.5 18.27,38.98 18.27,42.77 10.79,50.24 10.79,58.42 8.31,60.91 8.31,69.27 10.85,71.81 10.85,83.87 12.7,85.72 J1.4
  Bottom 0.305: IC7.5 40.91,34.47 32.94,34.47 IC8.5 30.75,34.47 22.78,34.47 IC9.5 20.59,34.47 12.62,34.47 IC10.5
N$1
  Top 0.305: 66.55,21.6 66.55,11.79 64.77,10.01 R10.1 | SJ3.1 66.55,21.6 | 66.55,21.6 68.86,21.6 70.02,22.75 70.02,40.97 IC1.3
N$2
  Top 0.305: IC1.1 73.18,49.53 66.55,42.9 SJ1.1 65.51,30.48 64.77,29.74 R8.1
N$3
  Top 0.305: 64.75,14.91 63.64,16.01 63.64,41.61 72.7,50.66 74.25,50.66 74.58,50.34 74.58,48.07 IC1.2 | 64.75,14.91 64.77,14.88 64.77,13.82 R9.1 | 64.75,14.91 65.94,16.1 65.94,19.36 65.51,19.79 65.51,26.67 SJ2.1
N$5
  Top 0.305: 37.61,83.05 37.61,82.68 38.38,81.92 39.05,81.92 39.86,81.11 39.86,74.15 C3.1 | R3.1 40.43,86.49 37.61,83.67 37.61,83.05 | 16.51,88.85 17.29,89.63 20.82,89.63 21.73,88.72 21.73,86.54 26.24,82.02 27.62,82.02 28.65,83.05 30.3,83.05 30.66,82.69 31.57,82.69 31.93,83.05 37.61,83.05 | 16.51,88.85 16.51,74.22 19.92,70.81 19.92,65.26 19.2,64.54 19.2,55.93 24.13,51 IC6.1 | 16.51,88.85 15.74,89.62 7.11,89.62 6.3,88.8 6.3,80.67 4.45,78.82 J3.5
N$6
  Top 0.305: R4.2 34.29,29.36 33.94,29.01 MD1.24
N$7
  Bottom 0.305: MD1.21 41.56,26.56 43.38,24.74 46.49,24.74 47.91,26.16 47.91,30.56 55.88,38.53 55.88,38.81 | 55.88,38.81 58.98,38.81 Q3.1 | R13.1 55.88,38.81
N$9
  Top 0.305: IC4.3 58.42,59.15 54.8,62.77 54.8,78.77 55.88,79.85 IC2.2
N$10
  Top 0.305: IC4.2 55.88,59.02 52.26,62.64 52.26,68.81 53.15,69.69 IC3.1
N$11
  Top 0.305: IC2.1 53.34,81.45 54.72,82.83 56.46,82.83 57.15,82.14 57.15,73.7 59.71,71.14 59.71,68.69 60.45,67.94 64.14,67.94 64.77,67.31 64.77,64.77 66.04,63.5 IC4.6
N$12
  Top 0.305: J4.11 76.12,83.82 69.15,90.79 35.05,90.79 SJ4.2
N$16
  Top 0.305: R11.1 27.79,83.19 30.34,85.74 35.31,85.74 36.58,87.01 SJ4.3
N$18
  Bottom 0.305: J5.3 9.53,55.3 11.35,57.12 28.07,57.12 IC5.3
N$19
  Bottom 0.305: IC5.6 35.09,56.52 12.06,56.52 10.79,55.24 10.79,51.44 10.16,50.8 7.62,50.8 6.99,51.44 J5.4
N$23
  Bottom 0.305: MD1.20 44.1,27.94 44.1,28.86 50.8,35.56 50.8,38.1 54.61,41.91 R12.1 Q2.1
N$27
  Bottom 0.305: R7.2 35.82,76.83 31.11,81.54 Q1.2
N$29
  Bottom 0.305: J2.2 8.26,64.77 8.99,64.03 19.27,64.03 23.33,68.09 28.82,68.09 32.36,71.62 44.3,71.62 45.16,70.77 69.1,70.77 76.12,63.74 76.12,63.5 J4.3
N$30
  Top 0.305: IC7.1 33.88,43.18 33.1,42.41 33.1,33.26 35.45,30.91 35.45,28.82 35.21,28.58 35.21,14.58 42.84,6.95 42.84,5.82 42.09,5.07 35.98,5.07 35.18,5.87 35.18,6.88 34.43,7.63 33.43,7.63 32.63,6.84 32.63,5.8 31.94,5.12 30.09,5.12 MD1.3
N$34
  Top 0.305: IC8.1 24.04,43.1 30.13,37.02 30.13,7.62 MD1.4
N$35
  Top 0.305: MD1.5 33.94,6.22 32.22,4.5 28.9,4.5 27.59,5.81 27.59,21.01 20.04,28.56 20.04,33.52 15.78,37.78 15.78,41.91 14.51,43.18 IC9.1
N$36
  Bottom 0.305: MD1.6 5.31,37.52 5.31,41.9 4.03,43.18 IC10.1
N$38
  Bottom 0.305: Q1.1 49.1,81.92 53.54,86.36 J4.12
R-ENC_A
  Top 0.305: MD1.9 44.1,6.99 37.75,13.34 37.75,29.48 35.29,31.94 35.29,44 34.74,44.55 34.03,44.55 IC6.4
R-ENC_B
  Top 0.305: IC6.6 36.83,37.59 40.29,34.13 40.29,16.51 46.64,10.16 MD1.10
R-ENC_SW
  Top 0.305: IC6.2 28.01,45.49 29.96,45.49 30.54,46.08 30.54,47.68 30.89,48.03 32.45,48.03 33.08,47.41 33.08,46.52 33.86,45.74 34.98,45.74 35.56,46.32 35.56,47.26 36.21,47.91 37.33,47.91 37.93,47.31 37.93,37.42 42.83,32.52 42.83,17.78 MD1.13
R_ENC_A
  Top 0.305: R1.2 26.67,73.81 25.25,72.39 25.25,69.83 27.75,67.33 27.75,48.29 IC6.3
  Bottom 0.305: J3.1 16.03,78.26 23.5,78.26 | 23.5,78.26 23.5,78.41 C1.1 | R1.2 26.67,76.05 24.46,78.26 23.5,78.26
R_ENC_B
  Top 0.305: IC6.5 34.29,47.21 36.45,49.37 36.45,52.32 35.43,53.34 33.53,53.34 33.02,53.85 33.02,56.13 32.64,56.52 30.86,56.52 30.48,56.9 30.48,59.69 29.21,60.96 29.21,64.01 30.48,65.28 30.48,67.31 R2.2
  Bottom 0.305: C2.1 30.48,74.78 27.3,71.6 R2.2 26.75,70.48 26.19,70.48 22.93,73.74 13.18,73.74 12.06,74.85 J3.2
RS
  Top 0.305: J4.4 80.09,66.04 82.52,63.61 82.52,46.52 81.71,45.72 79.22,45.72 75.41,41.91 IC1.4
RW
  Bottom 0.305: J4.5 80.09,68.58 83.16,65.51 83.16,41.25 82.55,40.64 76.2,40.64 74.93,39.37 IC1.5
RX
  Bottom 0.305: JP1.1 72.44,26.67 69.89,24.12 41.57,24.12 MD1.22
SCK
  Top 0.305: MD1.18 49.18,30.93 IC7.6 | IC10.6 10.26,36.83 2.54,36.83 1.91,37.47 1.91,68.58 8.26,74.93 8.26,83.82 10.16,85.72 J1.5
  Bottom 0.305: IC10.6 12.63,36.99 20.58,36.99 IC9.6 22.79,36.99 30.74,36.99 IC8.6 32.95,36.99 40.9,36.99 IC7.6
SDCARD_CS
  Top 0.305: MD1.15 56.8,26.71 44.61,38.9 44.61,39.63 42.33,41.91 41.73,41.91 40.68,42.96 40.68,55.84 40.01,56.52 34.16,56.52 33.02,57.66 33.02,59.69 35.56,62.23 35.56,67.31 33.02,69.85 33.02,72.69 31.75,73.97 31.75,75.26 20.34,86.67 20.32,86.67 J1.1
SDCARD_DETECT
  Top 0.305: MD1.8 32.67,15.24 32.67,30.67 30.75,32.59 30.75,40.02 25.53,45.24 25.53,64.77 25.53,67.18 22.86,69.85 22.86,74.11 17.78,79.19 J1.2
SPI_HOLD
  Top 0.305: MD1.16 54.26,28.39 IC7.7
  Bottom 0.305: IC7.7 40.89,39.53 32.96,39.53 IC8.7 30.74,39.53 22.79,39.53 IC9.7 20.59,39.55 12.62,39.55 IC10.7
TO_STM32
  Top 0.305: IC2.3 59.53,80.01 79.33,80.01 84.98,74.36 84.98,20.21 83.82,19.05 81.28,19.05 79.38,17.14 79.38,9.53 78.74,8.89 JP2.4
TX
  Bottom 0.305: JP1.2 76.25,26.67 76.25,26.72 73.02,23.49 39.66,23.49 MD1.23
VCC
  Bottom 0.305: MD1.27 37.22,15.77 61.7,15.77 62.87,14.61 73.03,14.61 74.93,16.51 JP2.1

### Text on the board
tNames: R | LCD | R | LCD | OR | microSD Card Slot | Rotary Encoder | NOR | NO | C1 | B1 | A1 | COM | XOR | AND | Display | Display Contrast | MIDI In Select | 23LC1024-I/P | 23LC1024-I/P | 23LC1024-I/P | 23LC1024-I/P | RX / / TX / / GND | Arduino MKR WiFi 1010 | VCC / / GND / / IN / / OUT | MIDI